# Altium schematic sheet Cover_Page.SchDoc
size 420 x 297 mm; Date: 24.02.2024; ApprovedBy: Arda B.; CheckedBy: Arda B.; CompanyName: -; DrawnBy: Arda Bozkurt; Revision: 001; SheetNumber: 1; SheetTotal: 2; Department: HDD; Size: A3
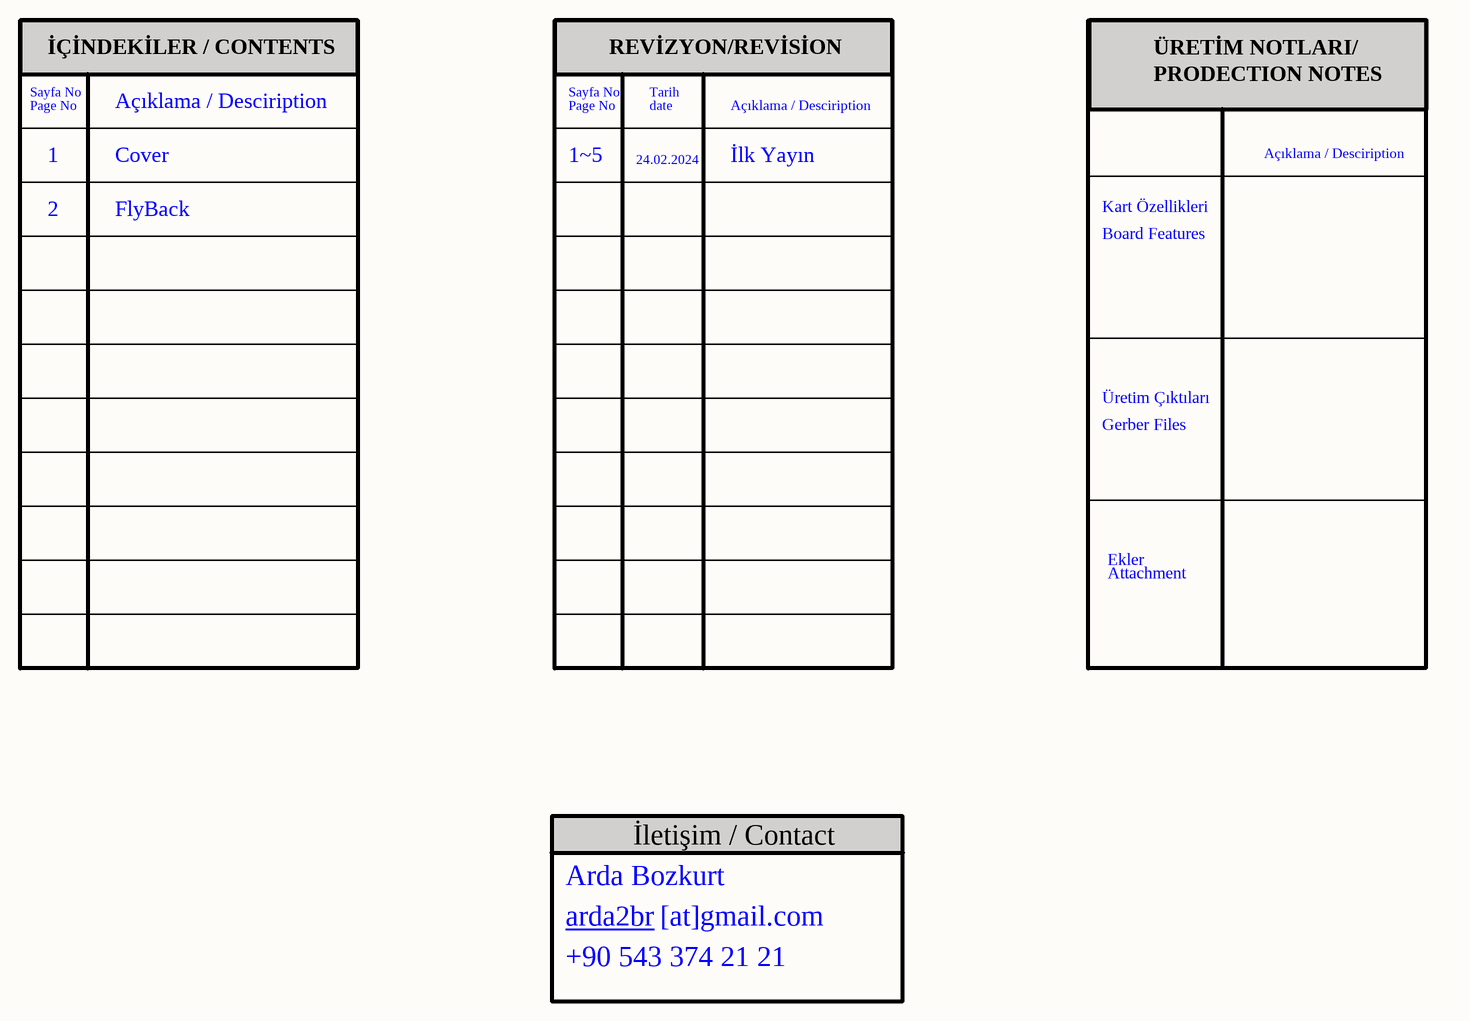
[diagram p0: Cover_Page.SchDoc]

## Notes on the sheet
- İÇİNDEKİLER / CONTENTS
- REVİZYON/REVİSİON
- ÜRETİM NOTLARI/
- PRODECTION NOTES
- Page No
- Sayfa No
- Açıklama / Desciription
- date
- Tarih
- 1
- 2
- Cover
- FlyBack
- 1~5
- 24.02.2024
- İlk Yayın
- Kart Özellikleri
- Board Features
- Üretim Çıktıları
- Gerber Files
- Ekler
- Attachment
- Arda Bozkurt
- İletişim / Contact
- arda2br
- +90 543 374 21 21
- [at]gmail.com
- REVİSİON
- DESCRIPTION
- DATE
- APPROVED
- DWG NO:
- TAINIM/DESCRIPTION
- REV:
- DOSYA ADI/FİLE NAME
- HAZIRLAYAN/PREPARED BY
- KONTROL EDEN/ CHECKED BY
- YAYIN TARİHİ/REL. DATE
- DEĞ TARİHİ/CHANCE DATE
- ONAYLAYAN/APPROVED BY
- REVİZYON/REVISION
- BÖLÜM/DEPARTMENT
- BOYUT/SİZE
- SAYFA/SHEET
- of